# Altium schematic sheet Blinker_Circuit.SchDoc
size A4
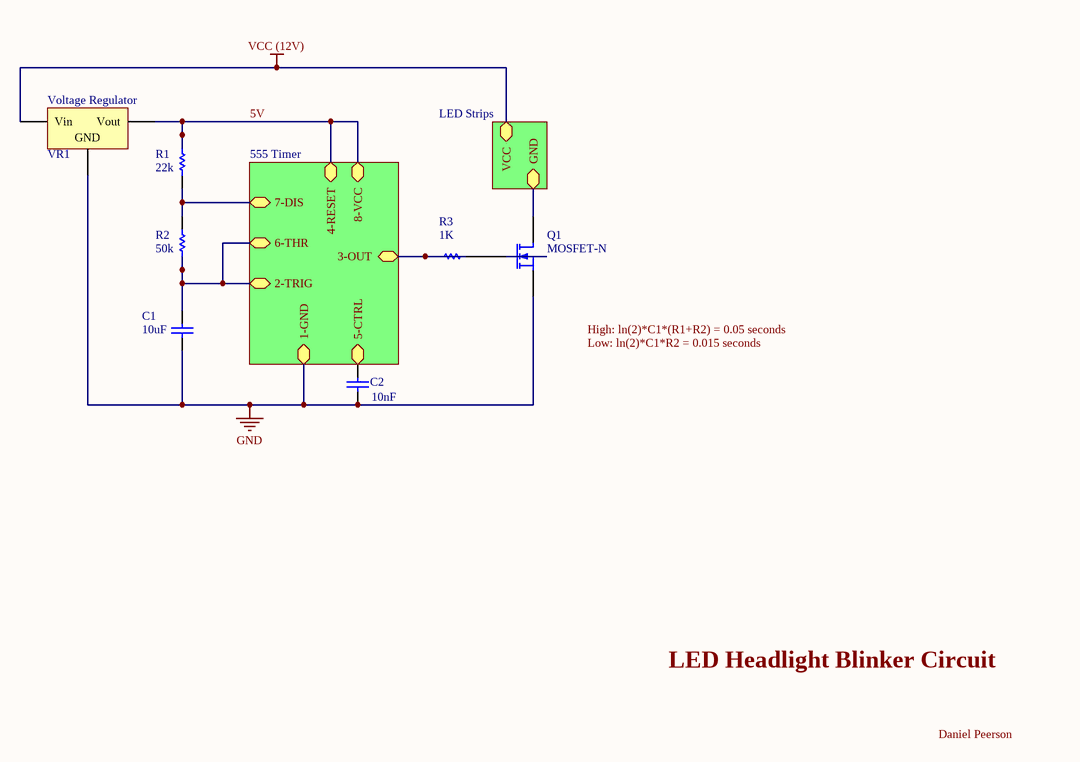
[diagram p0: Blinker_Circuit.SchDoc]

## Parts
C1  value 10uF  [RAD-0.3]  (hidden comment: Cap)
C2  value 10nF  [RAD-0.3]  (hidden comment: Cap)
Q1  MOSFET-N  [E3]
R1  value 22k  [AXIAL-0.3]  (hidden comment: Res1)
R2  value 50k  [AXIAL-0.3]  (hidden comment: Res1)
R3  value 1K  [AXIAL-0.3]  (hidden comment: Res1)
VR1  Voltage Regulator  [D2PAK_N]

## Sub-sheets
555 Timer = File Name: 7-DIS, 6-THR, 2-TRIG, 5-CTRL, 1-GND, 8-VCC, 4-RESET, 3-OUT
LED Strips = File Name: VCC, GND

## Nets
GND: C1.1 C2.1 Q1.3(S) VR1.2(GND) ; sheet 555 Timer/1-GND
VCC (12V): VR1.1(Vin) ; sheet LED Strips/VCC
5V: R1.2 VR1.3(Vout) ; sheet 555 Timer/8-VCC, sheet 555 Timer/4-RESET
NetC1_2: C1.2 R2.1 ; sheet 555 Timer/6-THR, sheet 555 Timer/2-TRIG
NetC2_2: C2.2 ; sheet 555 Timer/5-CTRL
NetQ1_1: Q1.1(D) ; sheet LED Strips/GND
NetQ1_2: Q1.2(G) R3.2
NetR1_1: R1.1 R2.2 ; sheet 555 Timer/7-DIS
NetR3_1: R3.1 ; sheet 555 Timer/3-OUT

## Notes on the sheet
- Labels drawn without touching a wire or pin: Daniel Peerson, High: ln(2)*C1*(R1+R2) = 0.05 seconds, LED Headlight Blinker Circuit, Low: ln(2)*C1*R2 = 0.015 seconds

## Library data of the parts
C1 C2 = Cap: Capacitor; Published: 8-Jun-2000; LatestRevisionDate: 17-Jul-2002; LatestRevisionNote: Re-released for DXP Platform.; PackageReference: RAD-0.3; Publisher: Altium Limited; PackageDescription: Radial Cap, Thru-Hole; 2 Leads; 0.3 in Pin Spacing
Q1 = MOSFET-N: N-Channel MOSFET; Published: 8-Jun-2000; LatestRevisionDate: 17-Jul-2002; LatestRevisionNote: Re-released for DXP Platform.; PackageVersion: 1995/1996; PackageReference: E3; Publisher: Altium Limited; PackageDescription: TO, Flat Index; 3 In-Line, Axial Leads; Body Dia. 4.6mm; Lead Dia. 0.5 mm (max)
R1-R3 = Res1: Resistor; Published: 8-Jun-2000; LatestRevisionDate: 17-Jul-2002; LatestRevisionNote: Re-released for DXP Platform.; PackageReference: AXIAL-0.3; Publisher: Altium Limited; PackageDescription: Axial Device, Thru-Hole; 2 Leads; 0.3 in Pin Spacing
VR1 = Volt Reg: Published: 24-Mar-1999; LatestRevisionDate: 29-May-2009; LatestRevisionNote: IPC-7351 Footprint Added.; PackageReference: D2PAK; Publisher: Altium Limited; PackageDescription: 3-Pin Transistor Outline Package 2.54 mm Pitch, 15.1 mm Lead Span